# EAGLE design GenericCommand (EAGLE 9.3.0)
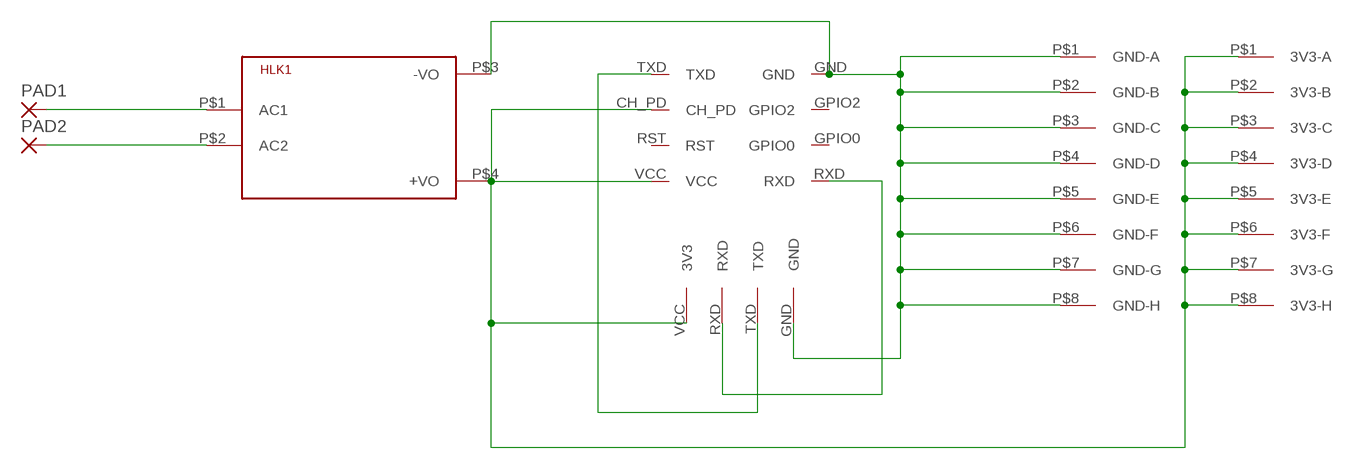
[diagram p0: schematic, sheet 1]

## Parts
HLK1  HLK-PM013W  [HLK-PM01]
PAD1  3,81/1,4  [3,81/1,4]
PAD2  3,81/1,4  [3,81/1,4]
U$1  ESP-01-SLOT  [ESP-01-SLOT]
U$2  CP-2102-CONN  [CP-2102-CONN]
U$3  3V3-8  [3.3V-8]
U$4  GND-8  [GND-8]

## Nets
N$1 [power]: HLK1.P$4(+VO) U$1.CH_PD U$1.VCC U$2.VCC(3V3) U$3.P$1(3V3-A) U$3.P$2(3V3-B) U$3.P$3(3V3-C) U$3.P$4(3V3-D) U$3.P$5(3V3-E) U$3.P$6(3V3-F) U$3.P$7(3V3-G) U$3.P$8(3V3-H)
N$2 [main]: HLK1.P$1(AC1) PAD1.1(P)
N$3 [power]: HLK1.P$3(-VO) U$1.GND U$2.GND U$4.P$1(GND-A) U$4.P$2(GND-B) U$4.P$3(GND-C) U$4.P$4(GND-D) U$4.P$5(GND-E) U$4.P$6(GND-F) U$4.P$7(GND-G) U$4.P$8(GND-H)
N$4: U$1.RXD U$2.RXD
N$5: U$1.TXD U$2.TXD
N$6 [main]: HLK1.P$2(AC2) PAD2.1(P)
Unconnected: U$1.GPIO0 U$1.GPIO2 U$1.RST

## Library data of the parts
HLK1 = HLK-PM01:HLK-PM01: Hi-Link Power Supply HLK-PM01 3W Author: Ahmed Said <https://github.com/AhmedSaid/EAGLELibraries>
PAD1 PAD2 = wirepad:3,81/1,4: THROUGH-HOLE PAD
U$1 = home-mind:ESP-01-SLOT
U$2 = home-mind:CP-2102-CONN
U$3 = home-mind:3V3-8
U$4 = home-mind:GND-8

## Net classes
0 default: width 0.3 mm, drill 0.3 mm, clearance 0.3 mm
1 power: width 1.2 mm, drill 0.5 mm, clearance 0.5 mm
2 main: width 3 mm, drill 1 mm, clearance 2 mm

## Board
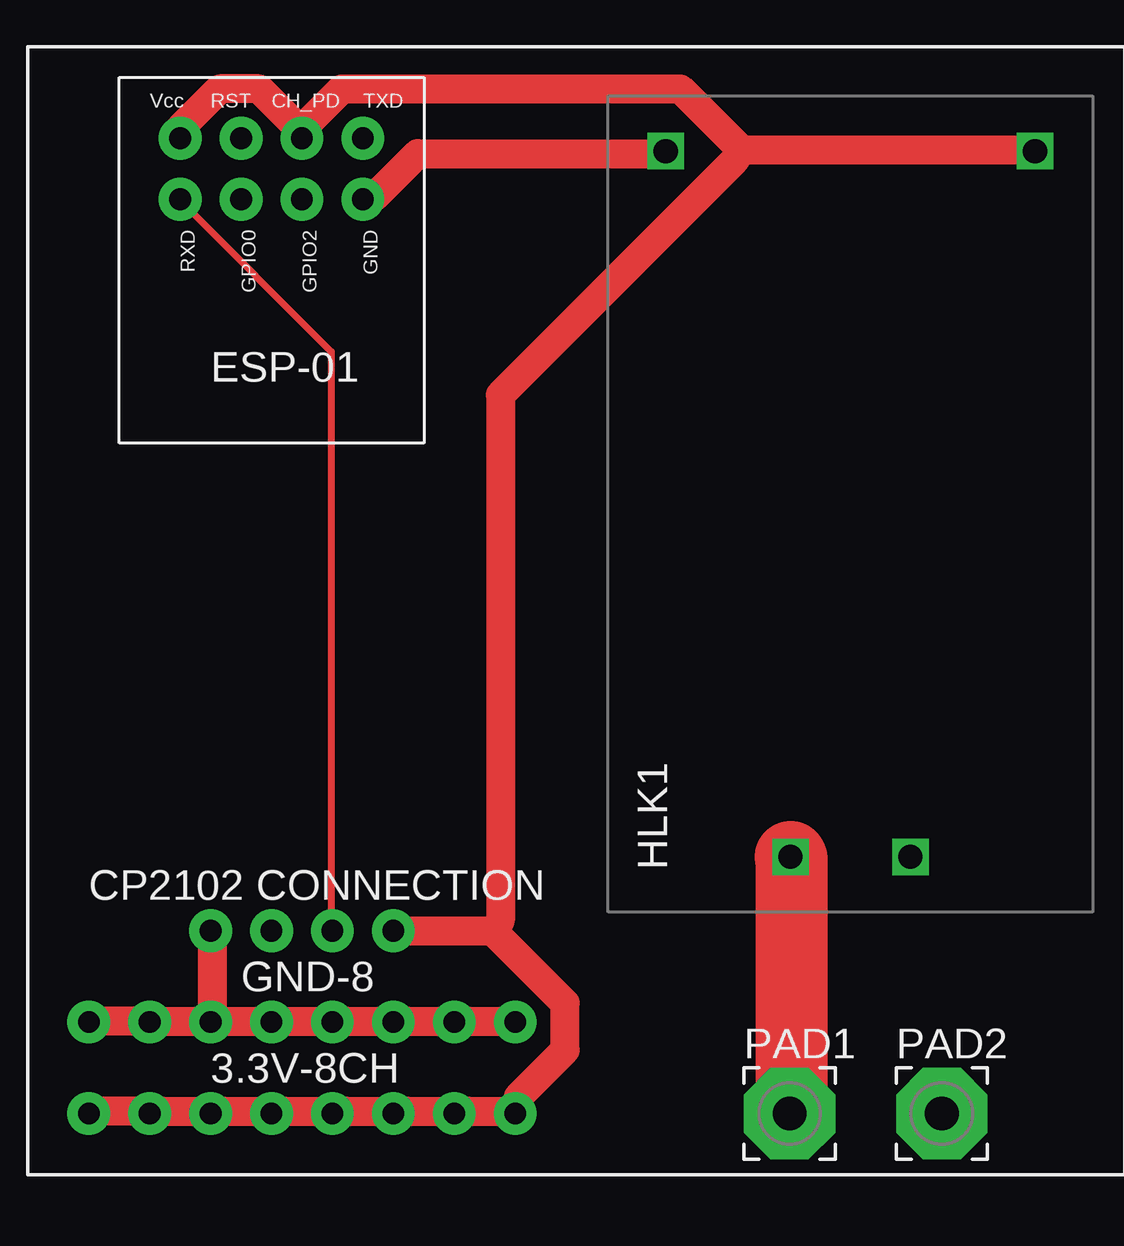
[diagram p1: board, top side]
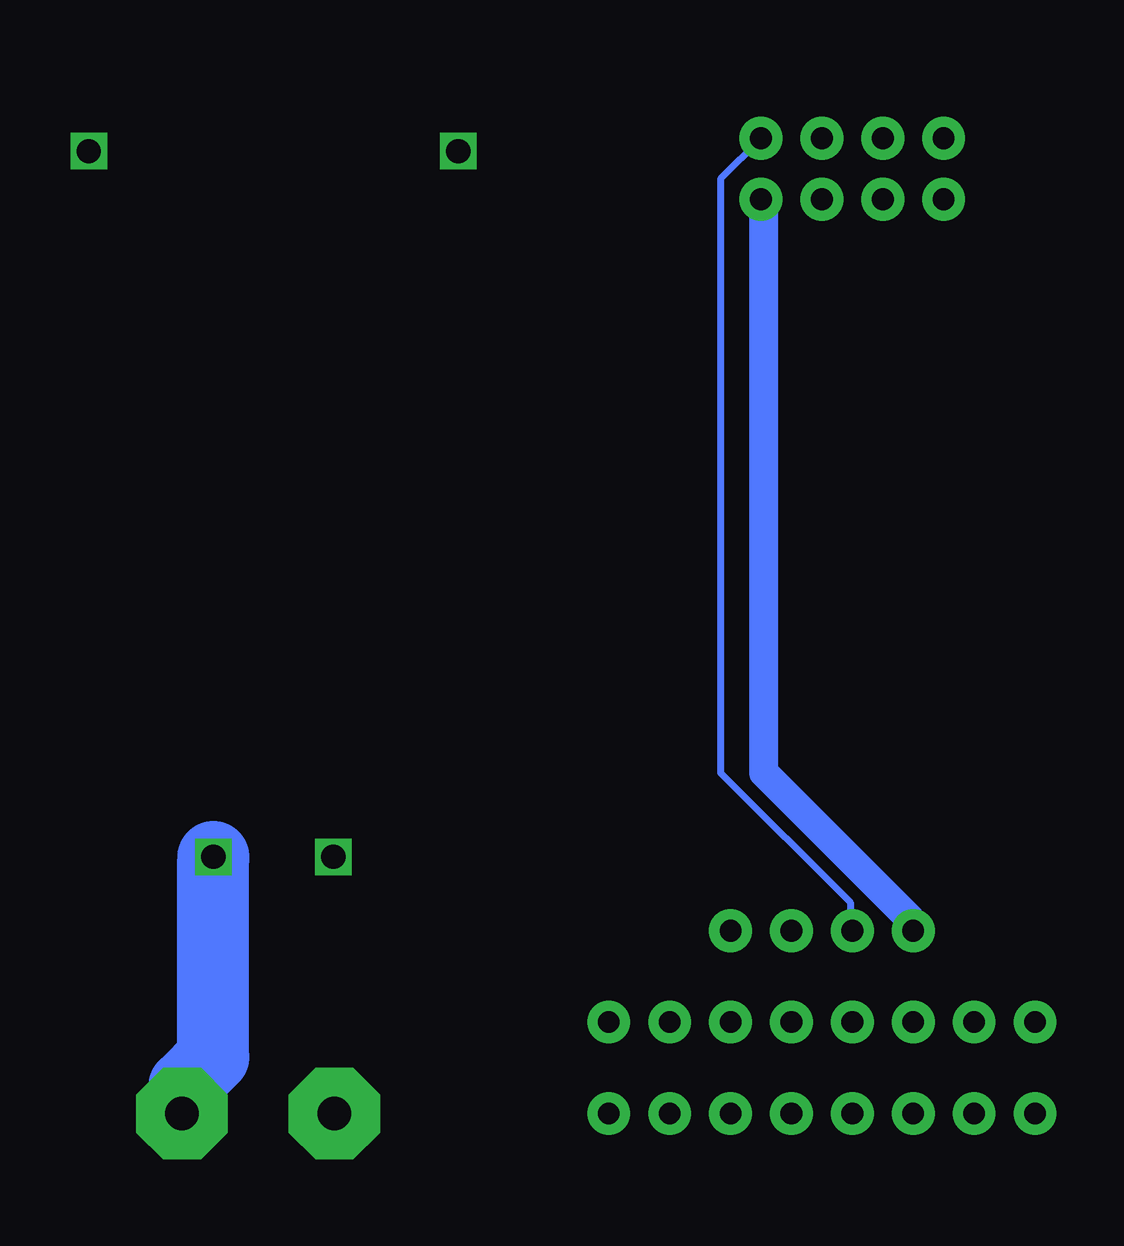
[diagram p2: board, bottom side, seen from below]

No outline drawn. Coordinates in mm, seen from the top.
Copper layers (1*16): Top 0.035mm / dielectric 1.5mm / Bottom 0.035mm
Design rules "default": minimum track width 6mil, minimum drill 0.35mm, track to track 6mil, track to pad 6mil, pad to pad 6mil, via to via 6mil, smd to smd 6mil, copper to edge 40mil, drill to drill 6mil, minimum pad ring 10mil, minimum via ring 8mil, stop-mask expansion 4mil, vias tented up to drill 0mil, thermal gap 10mil

### Footprints (pad centres in the part's own frame; a part is rotated, then mirrored left to right if it is on the bottom)
HLK-PM01 = drill 1.016 square: P$1 -14.7,2.5; P$2 -14.7,-2.5; P$3 14.7,7.7; P$4 14.7,-7.7
3,81/1,4 = drill 1.397 pad 3.81 octagon: 1 0,0
ESP-01-SLOT = drill 0.9 pad 1.778: CH_PD 1.27,1.27; GND 3.81,-1.27; GPIO0 -1.27,-1.27; GPIO2 1.27,-1.27; RST -1.27,1.27; RXD -3.81,-1.27; TXD 3.81,1.27; VCC -3.81,1.27
CP-2102-CONN = drill 0.9 pad 1.778: GND 0,-3.81; RXD 0,1.27; TXD 0,-1.27; VCC 0,3.81
3.3V-8 = drill 0.9 pad 1.778: P$1 0,0; P$2 2.54,0; P$3 5.08,0; P$4 7.62,0; P$5 10.16,0; P$6 12.7,0; P$7 15.24,0; P$8 17.78,0
GND-8 = drill 0.9 pad 1.778: P$1 0,0; P$2 2.54,0; P$3 5.08,0; P$4 7.62,0; P$5 10.16,0; P$6 12.7,0; P$7 15.24,0; P$8 17.78,0

### Placement (x,y rotation side)
HLK1  27.94,-6.35 90 top
PAD1  25.4,-31.75 0 top
PAD2  31.75,-31.75 0 top
U$1  3.81,7.62 0 top
U$2  5.08,-24.13 270 top
U$3  -3.81,-31.75 0 top
U$4  -3.81,-27.94 0 top

### Tracks (layer width: path | path; a pad name or v marks a point on that pad's centre or on a via)
N$1
  Top 1.2: U$3.P$1 -3.75,-31.65 -1.35,-31.65 U$3.P$2 -0.75,-31.65 1.2,-31.65 U$3.P$3 1.8,-31.65 3.75,-31.65 U$3.P$4 4.35,-31.65 6.3,-31.65 U$3.P$5 6.9,-31.65 8.85,-31.65 U$3.P$6 9.45,-31.65 11.4,-31.65 U$3.P$7 12,-31.65 13.95,-31.65 U$3.P$8 14.1,-31.05 16.05,-29.1 16.05,-27.15 13.05,-24.15 | 13.05,-24.15 9,-24.15 U$2.VCC | 23.4,8.4 35.55,8.4 HLK1.P$4 | 23.4,8.4 20.85,10.95 6.75,10.95 5.1,9.3 5.1,9 U$1.CH_PD 4.65,9.6 3.3,10.95 1.65,10.95 0,9.3 U$1.VCC | 13.05,-24.15 13.35,-23.7 13.35,-1.8 23.1,7.95 23.4,8.4
N$2
  Top 3: HLK1.P$1 25.5,-21.15 25.5,-31.65 PAD1.1
N$3
  Top 1.2: HLK1.P$3 20.1,8.25 9.9,8.25 8.1,6.45 7.65,6.45 U$1.GND | U$4.P$1 -3.75,-27.9 -1.35,-27.9 U$4.P$2 -0.75,-27.9 1.2,-27.9 U$4.P$3 | U$4.P$3 1.8,-27.9 3.75,-27.9 U$4.P$4 4.35,-27.9 6.3,-27.9 U$4.P$5 6.9,-27.9 8.85,-27.9 U$4.P$6 9.45,-27.9 11.4,-27.9 U$4.P$7 12,-27.9 13.95,-27.9 U$4.P$8 | U$2.GND 1.35,-24.15 1.35,-27.3 U$4.P$3
  Bottom 1.2: U$1.GND 7.5,6.3 7.5,-17.55 1.35,-23.7 1.35,-24 U$2.GND
N$4
  Top 0.3: U$2.RXD 6.3,-24 6.3,0 0,6.3 U$1.RXD
N$5
  Bottom 0.3: U$2.TXD 3.9,-24 3.9,-22.95 9.3,-17.55 9.3,7.2 7.65,8.85 U$1.TXD
N$6
  Bottom 3: HLK1.P$2 30.45,-21.15 30.45,-29.4 31.65,-30.6 31.65,-31.65 PAD2.1